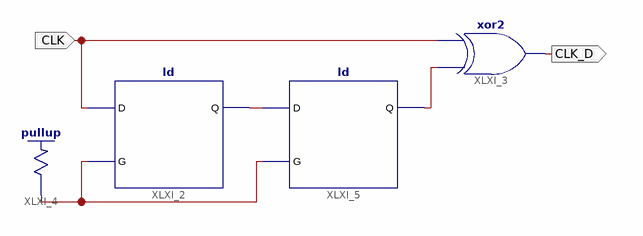
[diagram p0: schematic sheet 1]
// Xilinx ISE schematic clk_doubler.sch (xbr) as structural Verilog: 4 symbols, 2 ports
module clk_doubler (
  input  CLK,
  output CLK_D
);

  wire XLXN_1, XLXN_4, XLXN_6;

  ld XLXI_2 (.D(CLK), .G(XLXN_4), .Q(XLXN_1));
  ld XLXI_5 (.D(XLXN_1), .G(XLXN_4), .Q(XLXN_6));
  \pullup  XLXI_4 (.O(XLXN_4));
  xor XLXI_3 (CLK_D, XLXN_6, CLK);
endmodule
